# Altium schematic sheet can.SchDoc
size A4; SheetNumber: 10; SheetTotal: 12
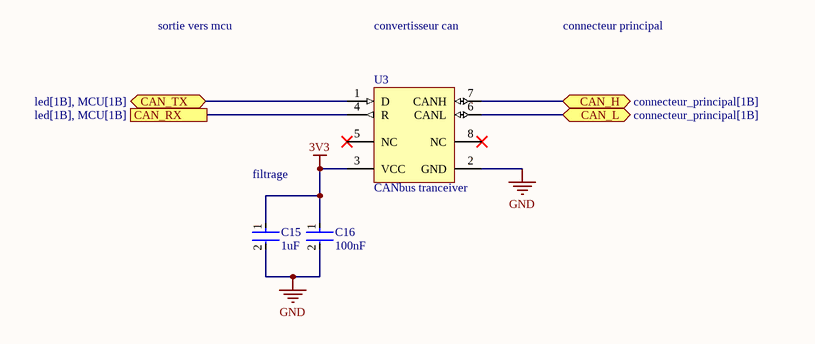
[diagram p0: can.SchDoc]

## Parts
C15  1uF  [FP-GRM155-0_05-IPC_A]
C16  100nF  [FP-CL278-IPC_A]
U3  CANbus tranceiver  [D0008A_M]

## Ports
CAN_H (bidir, see connecteur_principal[1B]), CAN_L (bidir, see connecteur_principal[1B]), CAN_RX (see led[1B], MCU[1B]), CAN_TX (bidir, see led[1B], MCU[1B])

## Nets
3V3: C15.1 C16.1 U3.3(VCC)
GND: C15.2 C16.2 U3.2(GND)
CAN_H: U3.7(CANH) ; port CAN_H
CAN_L: U3.6(CANL) ; port CAN_L
CAN_RX: U3.4(R) ; port CAN_RX
CAN_TX: U3.1(D) ; port CAN_TX

Not connected (* = marked no-connect by the designer): U3 5(NC)* 8(NC)*

## Notes on the sheet
- sortie vers mcu
- convertisseur can
- connecteur principal
- filtrage

## Library data of the parts
C15 = GRM155R61E105MA12D: Multilayer Ceramic Capacitor, 1 uF, 25 V, ± 20%, X5R, 0402 [1005 Metric]; Manufacturer: Murata; Voltage Rating: 25V; Supplier: Digikey; Supplier Part Number: 490-10018-1-ND; Manufacturer Part Number: GRM155R61E105MA12D; RoHS: Yes; Category: Ceramic Capacitors; Stock: 2496490; Pricing: 1=0.1, 10=0.066, 50=0.0376, 100=0.0292, 500=0.022, 1000=0.01728, 2500=0.01571, 5000=0.01445 (USD); Mounting Technology: Surface Mount; Case/Package: 0402; Case Code (Metric): 1005; Case Code (Imperial): 0402; Weight: 0.000212oz; Min Operating Temperature: -55°C; Max Operating Temperature: 85°C; Value: 1uF; Packaging: Tape and Reel; Tolerance: 20%; Dielectric: X5R; Termination: SMD/SMT; Voltage Rating (DC): 25V; Package Quantity: 10000; Series: GRM; Length: 0.039inch; Width: 0.02inch; Height: 0.5mm; Thickness: 0.022inch; RoHS Compliant: Yes; ComponentLink1URL: http://www.mouser.com/ds/2/281/c02e-2905.pdf?src-supplier=Mouser; ComponentLink1Description: http://www.mouser.com/ds/2/281/c02e-2905.pdf?src-supplier=Mouser; ComponentLink2URL: https://datasheet.octopart.com/GRM155R61E105MA12D-Murata-datasheet-149523023.pdf?src-supplier=Newark; ComponentLink2Description: https://datasheet.octopart.com/GRM155R61E105MA12D-Murata-datasheet-149523023.pdf?src-supplier=Newark; ComponentLink3URL: https://datasheet.octopart.com/GRM155R61E105MA12D-Murata-datasheet-22122223.pdf?src-supplier=Future+Electronics; ComponentLink3Description: https://datasheet.octopart.com/GRM155R61E105MA12D-Murata-datasheet-22122223.pdf?src-supplier=Future+Electronics; ComponentLink4URL: http://search.murata.co.jp/Ceramy/image/img/A01X/G101/ENG/GRM155R61E105MA12-01.pdf?src-supplier=Digikey; ComponentLink4Description: http://search.murata.co.jp/Ceramy/image/img/A01X/G101/ENG/GRM155R61E105MA12-01.pdf?src-supplier=Digikey
C16 = CL05A104KA5NNNC: Multilayer Ceramic Capacitor, 0.1 uF, 25 V, ± 10%, X5R, 0402 [1005 Metric]; Manufacturer: Samsung; Material: 4241ConductorMaterial; Voltage Rating: 25V; Supplier: Digikey; Supplier Part Number: 1276-1043-1-ND; Manufacturer Part Number: CL05A104KA5NNNC; RoHS: Yes; Category: Ceramic Capacitors; Stock: 11930039; Pricing: 1=0.1, 10=0.01, 50=0.0054, 100=0.0042, 500=0.00318, 1000=0.0025, 2500=0.00227, 5000=0.00209 (USD); Mounting Technology: Surface Mount; Case/Package: 0402; Case Code (Metric): 1005; Case Code (Imperial): 0402; Min Operating Temperature: -55°C; Max Operating Temperature: 85°C; Value: 100nF; Packaging: Tape and Reel; Tolerance: 10%; Dielectric: X5R; Voltage: 25V; Series: CL; Construction: Flat; Package Quantity: 1; Voltage Rating (DC): 25V; Length: 1mm; Width: 0.02inch; Height: 0.5mm; Depth: 0.5mm; Thickness: 0.022inch; Radiation Hardening: No; RoHS Compliant: Yes; Lead Free: Lead Free; ComponentLink1URL: https://datasheet.ciiva.com/25802/cl05a104ka5nnnc-25802704.pdf?src-supplier=Digikey; ComponentLink1Description: https://datasheet.ciiva.com/25802/cl05a104ka5nnnc-25802704.pdf?src-supplier=Digikey; ComponentLink2URL: https://datasheet.ciiva.com/16437/cl05a104ka5nnnc-16437369.pdf?src-supplier=Future+Electronics; ComponentLink2Description: https://datasheet.ciiva.com/16437/cl05a104ka5nnnc-16437369.pdf?src-supplier=Future+Electronics; ComponentLink3URL: https://datasheet.ciiva.com/26838/getdatasheetpartid-357412-26838142.pdf?src-supplier=Verical; ComponentLink3Description: https://datasheet.ciiva.com/26838/getdatasheetpartid-357412-26838142.pdf?src-supplier=Verical; ComponentLink4URL: https://datasheet.ciiva.com/26309/mlcc-catalogdownload2013-eng-26309014.pdf?src-supplier=Distrelec; ComponentLink4Description: https://datasheet.ciiva.com/26309/mlcc-catalogdownload2013-eng-26309014.pdf?src-supplier=Distrelec
U3 = SN65HVD232DR: EAR99 65HVD232 Tape & Reel (TR) CANbus interface receiver 100mV 17mA 72.603129mg 1Mbps; Manufacturer: Texas Instruments; Min Supply Voltage: 3V; Max Supply Voltage: 3.6V; Number of Transceivers: 1; Simplex/Duplex: Half Duplex; Supplier: Digikey; RoHS: Yes; Category: Interface ICs; Stock: 18370; Pricing: 1=2.5, 10=2.246, 25=2.1184, 100=1.8049, 250=1.6948, 500=1.48294, 1000=1.22872 (USD); Case/Package: D; Pins: 8; Weight: 0.002561oz; Min Operating Temperature: -40°C; Max Operating Temperature: 85°C; Packaging: Tape and Reel; Data Rate: 1Mbps; Package Quantity: 2500; Number of Drivers: 1; Number of Receivers: 1; Series: -; Supply Current: 17mA; Number of Transmit Buffers: 1; Number of Receive Buffers: 1; Receiver Hysteresis: 100mV; Radiation Hardening: No; Lead Free: Lead Free; RoHS Compliant: Yes; Reach SVHC Compliant: No; ComponentLink1URL: https://datasheet.ciiva.com/1771/sn65hvd230-1771113.pdf?src-supplier=Digikey; ComponentLink1Description: https://datasheet.ciiva.com/1771/sn65hvd230-1771113.pdf?src-supplier=Digikey; ComponentLink2URL: https://datasheet.ciiva.com/1771/sn65hvd230-1771112.pdf?src-supplier=Digikey; ComponentLink2Description: https://datasheet.ciiva.com/1771/sn65hvd230-1771112.pdf?src-supplier=Digikey; ComponentLink3URL: https://datasheet.ciiva.com/1771/sn65hvd230-1771114.pdf?src-supplier=Digikey; ComponentLink3Description: https://datasheet.ciiva.com/1771/sn65hvd230-1771114.pdf?src-supplier=Digikey; ComponentLink4URL: https://datasheet.ciiva.com/15149/getdatasheetpartid-107534-15149958.pdf?src-supplier=Verical; ComponentLink4Description: https://datasheet.ciiva.com/15149/getdatasheetpartid-107534-15149958.pdf?src-supplier=Verical; Supplier Part Number: 296-26344-1-ND; Manufacturer Part Number: SN65HVD232DR